# Altium schematic sheet Schematic.SchDoc
size A3; SheetNumber: 2; SheetTotal: 2
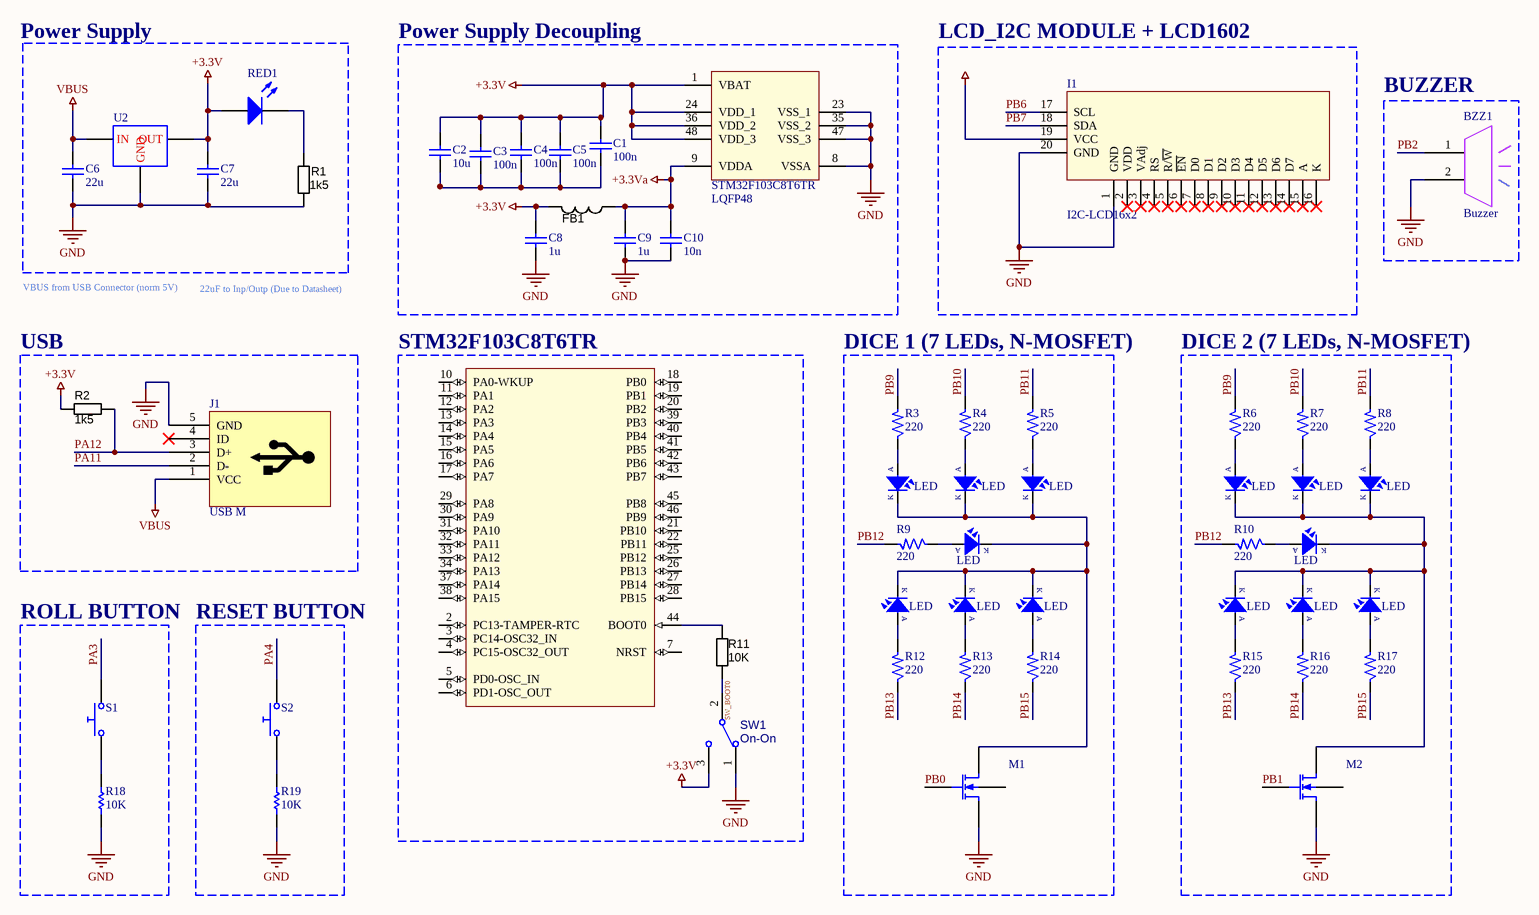
[diagram p0: Schematic.SchDoc]

## Parts
BZZ1  Buzzer  [buzzer 5V]
C1  value 100n  [C 0402]  (hidden comment: Capacitor)
C2  value 10u  [C 0402]  (hidden comment: Capacitor)
C3  value 100n  [C 0402]  (hidden comment: Capacitor)
C4  value 100n  [C 0402]  (hidden comment: Capacitor)
C5  value 100n  [C 0402]  (hidden comment: Capacitor)
C6  value 22u  [C 0805]  (hidden comment: Capacitor)
C7  value 22u  [C 0805]  (hidden comment: Capacitor)
C8  value 1u  [C 0402]  (hidden comment: Capacitor)
C9  value 1u  [C 0402]  (hidden comment: Capacitor)
C10  value 10n  [C 0402]  (hidden comment: Capacitor)
FB1  2K2 @ 100 MHz  [FBC1608X95N]  (value not drawn)
I1  I2C-LCD16x2  [I2C-LCD16X2]
J1  USB M  [USB-Micr-B-FCI-SMD]
LED1  LED  [LED-3]
LED2  LED  [LED-3]
LED3  LED  [LED-3]
LED4  LED  [LED-3]
LED5  LED  [LED-3]
LED6  LED  [LED-3]
LED7  LED  [LED-3]
LED8  LED  [LED-3]
LED9  LED  [LED-3]
LED10  LED  [LED-3]
LED11  LED  [LED-3]
LED12  LED  [LED-3]
LED13  LED  [LED-3]
LED14  LED  [LED-3]
M1  N-channel MOS1 MOSFET Shichman and Hodges Model  (value not drawn)
M2  N-channel MOS1 MOSFET Shichman and Hodges Model  (value not drawn)
R1  value 1k5  [RESC1005X40N]  (hidden comment: Thick Film)
R2  value 1k5  [RESC1005X40N]  (hidden comment: Thick Film)
R3  220  [R1/4W]
R4  220  [R1/4W]
R5  220  [R1/4W]
R6  220  [R1/4W]
R7  220  [R1/4W]
R8  220  [R1/4W]
R9  220  [R1/4W]
R10  220  [R1/4W]
R11  value 10K  [RESC1005X40N]  (hidden comment: Thick Film)
R12  220  [R1/4W]
R13  220  [R1/4W]
R14  220  [R1/4W]
R15  220  [R1/4W]
R16  220  [R1/4W]
R17  220  [R1/4W]
R18  value 10K  (hidden comment: Resistor)
R19  value 10K  (hidden comment: Resistor)
RED1  Light-Emitting Diode  [LED-RED-0805]  (value not drawn)
S1  Push Button Normally Opened  (value not drawn)
S2  Push Button Normally Opened  (value not drawn)
SW1  ON-ON  [SW4_SMD]
U1  STM32F103C8T6TR  [STM-LQFP48_M]  (value not drawn)  (parts A,B of 2)
U2  Positive Fixed Voltage regulator  [AMS1117_3v3]  (value not drawn)

## Blocks framed on the sheet
Power Supply: C6 C7 R1 RED1 U2
Power Supply Decoupling: C1-C5 C8-C10 FB1 U1
LCD_I2C MODULE + LCD1602: I1
BUZZER: BZZ1
USB: J1 R2
STM32F103C8T6TR: R11 SW1 U1
DICE 1 (7 LEDs, N-MOSFET): LED1-LED3 LED7 LED9-LED11 M1 R3-R5 R9 R12-R14
DICE 2 (7 LEDs, N-MOSFET): LED4-LED6 LED8 LED12-LED14 M2 R6-R8 R10 R15-R17
ROLL BUTTON: R18 S1
RESET BUTTON: R19 S2

## Nets
+3.3V: C1.1 C2.1 C3.1 C4.1 C5.1 C7.1 C8.1 FB1.2 R2.1 RED1.1(A) SW1.3 U1.1(VBAT) U1.24(VDD_1) U1.36(VDD_2) U1.48(VDD_3) U2.3(OUT)
+3.3Va: C9.1 C10.1 FB1.1 U1.9(VDDA)
GND: BZZ1.2 C6.2 C7.2 C8.2 C9.2 C10.2 I1.1(GND) I1.20(GND) J1.5(GND) M1.3(S) M2.3(S) R1.1 R18.1 R19.1 SW1.1 U1.8(VSSA) U1.23(VSS_1) U1.35(VSS_2) U1.47(VSS_3) U2.2(GND)
VBUS: C6.1 J1.1(VCC) U2.1(IN)
PA3: S1.2
PA4: S2.2
PA11: J1.2(D-)
PA12: J1.3(D+) R2.2
PB0: M1.2(G)
PB1: M2.2(G)
PB2: BZZ1.1
PB6: I1.17(SCL)
PB7: I1.18(SDA)
PB9: R3.2 R6.2
PB10: R4.2 R7.2
PB11: R5.2 R8.2
PB12: R9.2 R10.2
PB13: R12.1 R15.1
PB14: R13.1 R16.1
PB15: R14.1 R17.1
SW_BOOT0: R11.2 SW1.2
NetC1_2: C1.2 C2.2 C3.2 C4.2 C5.2
NetLED1_1: LED1.1(A) R3.1
NetLED1_2: LED1.2(K) LED2.2(K) LED3.2(K) LED7.2(K) LED9.2(K) LED10.2(K) LED11.2(K) M1.1(D)
NetLED2_1: LED2.1(A) R4.1
NetLED3_1: LED3.1(A) R5.1
NetLED4_1: LED4.1(A) R6.1
NetLED4_2: LED4.2(K) LED5.2(K) LED6.2(K) LED8.2(K) LED12.2(K) LED13.2(K) LED14.2(K) M2.1(D)
NetLED5_1: LED5.1(A) R7.1
NetLED6_1: LED6.1(A) R8.1
NetLED7_1: LED7.1(A) R9.1
NetLED8_1: LED8.1(A) R10.1
NetLED9_1: LED9.1(A) R12.2
NetLED10_1: LED10.1(A) R13.2
NetLED11_1: LED11.1(A) R14.2
NetLED12_1: LED12.1(A) R15.2
NetLED13_1: LED13.1(A) R16.2
NetLED14_1: LED14.1(A) R17.2
NetR1_2: R1.2 RED1.2(K)
NetR11_1: R11.1 U1.44(BOOT0)
NetR18_2: R18.2 S1.1
NetR19_2: R19.2 S2.1

Not connected (* = marked no-connect by the designer): I1 2(VDD)* 3(VAdj)* 4(RS)* 5(R/~{W})* 6(~{EN})* 7(D0)* 8(D1)* 9(D2)* 10(D3)* 11(D4)* 12(D5)* 13(D6)* 14(D7)* 15(A)* 16(K)* 19(VCC); J1 4(ID)*; M1 4(B); M2 4(B); U1 2(PC13-TAMPER-RTC) 3(PC14-OSC32_IN) 4(PC15-OSC32_OUT) 5(PD0-OSC_IN) 6(PD1-OSC_OUT) 7(NRST) 10(PA0-WKUP) 11(PA1) 12(PA2) 13(PA3) 14(PA4) 15(PA5) 16(PA6) 17(PA7) 18(PB0) 19(PB1) 20(PB2) 21(PB10) 22(PB11) 25(PB12) 26(PB13) 27(PB14) 28(PB15) 29(PA8) 30(PA9) 31(PA10) 32(PA11) 33(PA12) 34(PA13) 37(PA14) 38(PA15) 39(PB3) 40(PB4) 41(PB5) 42(PB6) 43(PB7) 45(PB8) 46(PB9)

## Notes on the sheet
- VBUS from USB Connector (norm 5V)
- 22uF to Inp/Outp (Due to Datasheet)

## Library data of the parts
C1-C10 = Capacitor: SimulationGenericComponent: True
FB1 = FERRITE_2K2-100MHz_0603: Ferrite bead 120 Ohm at 100 MHz 200mA 0603 SMD; Manufacturer 1: TDK Corporation; Manufacturer Part Number 1: MMZ1608A222B; Ratings: 200 mA; 800 mOhm DC; Impedance @ Frequency: 2200 Ohm @ 100MHz; DC Resistance (DCR): 800 mOhm Max; Filter Type: Differential Mode - Single; SCDType: source; Size / Dimension: 0.063" L x 0.031" W (1.60mm x 0.80mm); Current Rating: 200mA; Package / Case: 0603 (1608 Metric); Height (Max): 0.037" (0.95mm); Mounting Type: Surface Mount; Supplier 1: Digi-Key; Supplier Part Number 1: 445-8671-1-ND; RoHS 1: RoHS Compliant; ComponentLink1URL: http://www.tdk.co.jp/tefe02/e9412_mmz.pdf; ComponentLink1Description: http://www.tdk.co.jp/tefe02/e9412_mmz.pdf; Value: 2K2 @ 100 MHz
I1 = I2C-LCD16x2: LCD dipslay 16 char, 2 line; Value: LCD16x2A
LED1-LED14 = LED: LED Single colour Green and Red; Value: LED 3 ly Single Colour
M1 M2 = MOSFET N-ch Lev1: CBD: 0; FC: 0.5; IS: 1e-14; KP: 2e-05; PB: 0.8; PHI: 0.6; TNOM: 27; SimulationGenericComponent: True; CBS: 0; CGBO: 0; CGDO: 0; CGSO: 0; CJ: 0; CJSW: 0; GAMMA: 0; JS: 0; LAMBDA: 0; LD: 0; MJ: 0.5; MJSW: 0.5; NSS: 0; NSUB: 0; RD: 0; RS: 0; RSH: 0; TOX: 0; TPG: 0; U0: 0; VTO: 0
R1 R2 R11 = RES_0402: Resistor SMD chip 1k Ohm 0.063W 5% 0402; Manufacturer 1: Yageo; Manufacturer Part Number 1: RC0402JR-071KL; Ratings: 1/16 W; SCDType: spec; Package / Case: 0402 (1005 Metric); Tolerance: ±5%; Supplier 1: Digi-Key; Supplier Part Number 1: 311-1.0KJRCT-ND; RoHS 1: RoHS Compliant; ComponentLink1URL: http://www.yageo.com/documents/recent/PYu-RC0402_51_RoHS_L_6.pdf; ComponentLink1Description: http://www.yageo.com/documents/recent/PYu-RC0402_51_RoHS_L_6.pdf; Supplier 2: Digi-Key; Supplier Part Number 2: 541-1.0KJCT-ND; Manufacturer 2: Vishay Dale; Manufacturer Part Number 2: CRCW04021K00JNED; RoHS 2: RoHS Compliant; ComponentLink2URL: http://www.vishay.com/doc?20035; ComponentLink2Description: http://www.vishay.com/doc?20035; Supplier 3: Digi-Key; Supplier Part Number 3: 1276-4376-1-ND; Manufacturer 3: Samsung Electro-Mechanics America, Inc; Manufacturer Part Number 3: RC1005J102CS; RoHS 3: RoHS Compliant; ComponentLink3URL: http://www.samsungsem.com/servlet/FileDownload?filename=productcatalog/pdf/Chip_Resistor.pdf; ComponentLink3Description: http://www.samsungsem.com/servlet/FileDownload?filename=productcatalog/pdf/Chip_Resistor.pdf; Supplier 4: Digi-Key; Supplier Part Number 4: RHM1.0KCECT-ND; Manufacturer 4: Rohm Semiconductor; Manufacturer Part Number 4: MCR01MRTJ102; RoHS 4: RoHS Compliant; ComponentLink4URL: http://rohmfs.rohm.com/en/products/databook/datasheet/passive/resistor/chip_resistor/mcr_g.pdf; ComponentLink4Description: http://rohmfs.rohm.com/en/products/databook/datasheet/passive/resistor/chip_resistor/mcr_g.pdf; Supplier 5: Digi-Key; Supplier Part Number 5: P1.0KJCT-ND; Manufacturer 5: Panasonic Electronic Components; Manufacturer Part Number 5: ERJ-2GEJ102X; RoHS 5: RoHS Compliant; ComponentLink5URL: http://industrial.panasonic.com/www-cgi/jvcr13pz.cgi?E+PZ+3+AOA0001+ERJ2GEJ102X+7+WW; ComponentLink5Description: http://industrial.panasonic.com/www-cgi/jvcr13pz.cgi?E+PZ+3+AOA0001+ERJ2GEJ102X+7+WW
R3-R10 R12-R17 = Res
R18 R19 = Resistor: TC1: 0; SimulationGenericComponent: True; TC2: 0
RED1 = LED: AF: 1; BV: 0; BV_MAX: 1e99; EG: 1.11; FC: 0.5; IBV: 0.001; IS: 1e-14; MJSW: 0.33; NTUN: 30; TNOM: 27; XTI: 3; SimulationGenericComponent: True; CJO: 0; CJP: 0; CTA: 0; CTP: 0; FCS: 0.5; FV_MAX: 1e99; IKF: 0; IKR: 0; ISR: 1e-14; JSW: 0; JTUN: 0; JTUNSW: 0; KEG: 1; KF: 0; LEVEL: 1; N: 1; NBV: 1; NR: 1; NS: 1; PHP: 1; RS: 0; TCV: 0; TLEV: 0; TLEVC: 0; TM1: 0; TM2: 0; TPB: 0; TPHP: 0; TRS: 0; TRS2: 0; TT: 0; TTT1: 0; TTT2: 0; VJ: 1; XTITUN: 3
S1 S2 = Push Button NO: closed: 0; Rclosed: 1m; Ropen: 1Meg; SimulationGenericComponent: True
SW1 = SW_THD_SPDT_On-On: Switch THD vertical toggle SPDT; Manufacturer 1: TE Connectivity; Manufacturer Part Number 1: SLS121PC04; Contact Rating @ Voltage: 0.25A @ 125VAC; SCDType: spec; Circuit: SPDT; Mounting Type: PCB mount; Supplier 1: Digi-Key; Supplier Part Number 1: 450-1598-ND; Switch Function: On-On
U1 = STM32F103C8T6TR: ARM Cortex-M3 32-bit MCU, 64 KB Flash, 20 KB Internal RAM, 37 I/Os, 48-pin LQFP, -40 to 85 degC, Tape and Reel; PACKAGE: LQFP48
U2 = Linear Voltage Regulator (Fixed): Av_feedback: 1665; R1_Value: 1020; SimulationGenericComponent: True